# Altium project 2016ship.PrjPcb
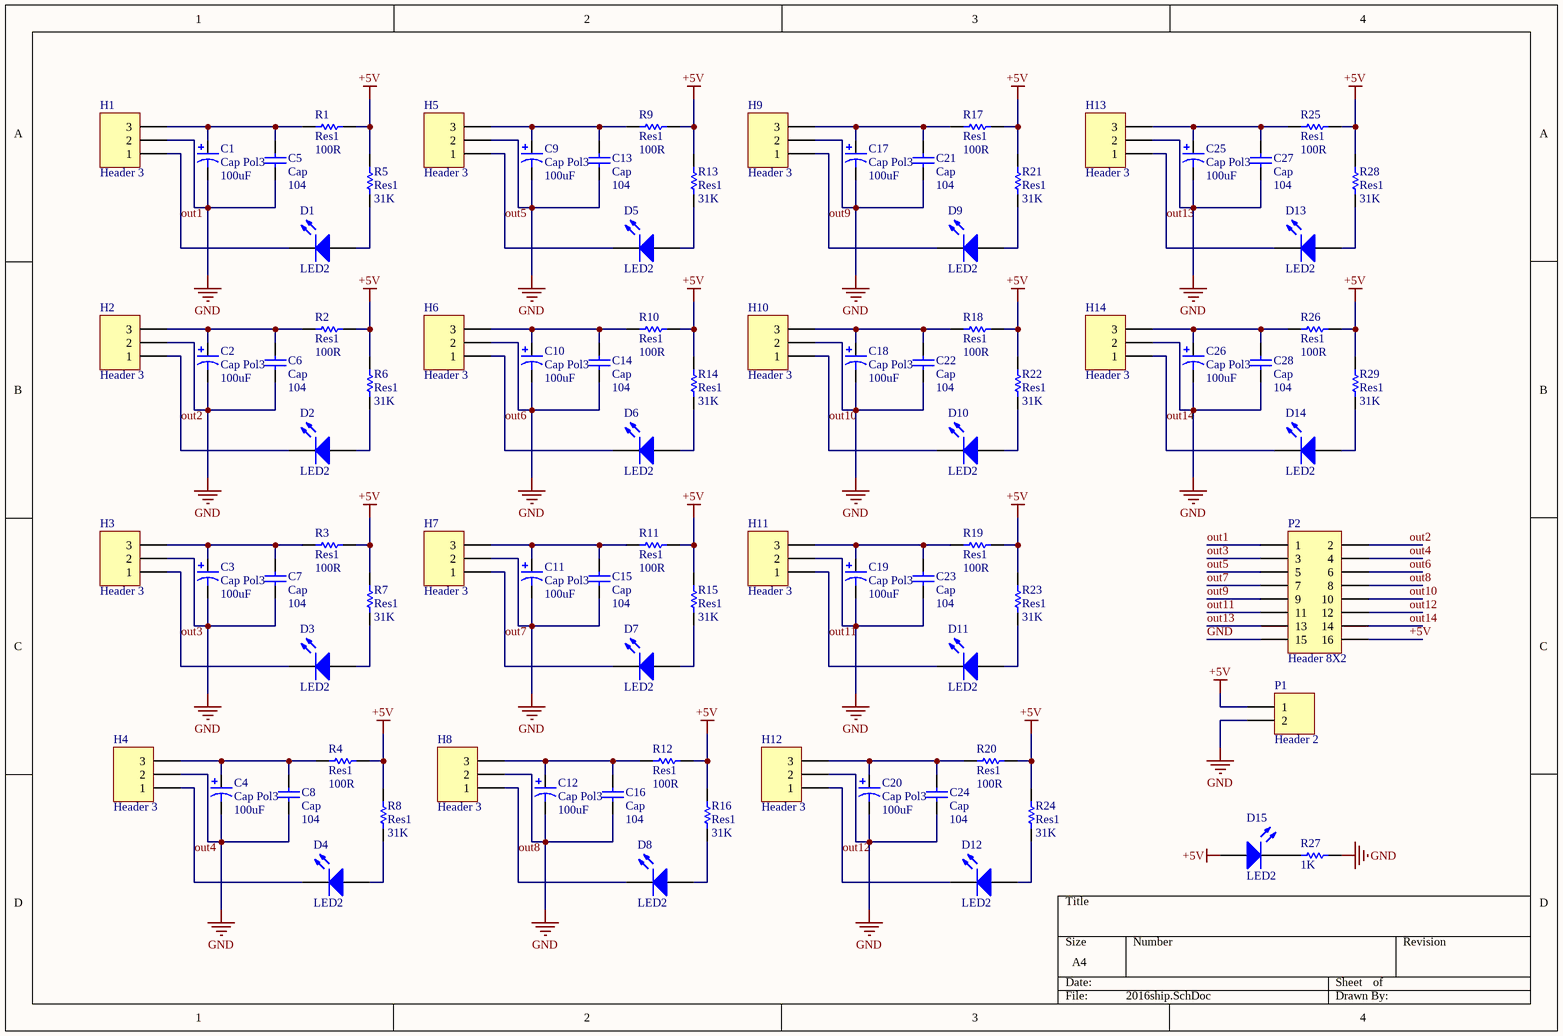
[diagram p0: 2016ship.SchDoc]
1 sheet, 88 parts. Net scope: global (net labels, ports and power ports of the same name join across sheets).
Board file: 2016ship.PcbDoc

## Sheet 2016ship.SchDoc
size A4

### Parts
C1  Cap Pol3  value 100uF  [7343]
C2  Cap Pol3  value 100uF  [7343]
C3  Cap Pol3  value 100uF  [7343]
C4  Cap Pol3  value 100uF  [7343]
C5  Cap  value 104  [0805C]
C6  Cap  value 104  [0805C]
C7  Cap  value 104  [0805C]
C8  Cap  value 104  [0805C]
C9  Cap Pol3  value 100uF  [7343]
C10  Cap Pol3  value 100uF  [7343]
C11  Cap Pol3  value 100uF  [7343]
C12  Cap Pol3  value 100uF  [7343]
C13  Cap  value 104  [0805C]
C14  Cap  value 104  [0805c]
C15  Cap  value 104  [0805C]
C16  Cap  value 104  [0805C]
C17  Cap Pol3  value 100uF  [7343]
C18  Cap Pol3  value 100uF  [7343]
C19  Cap Pol3  value 100uF  [7343]
C20  Cap Pol3  value 100uF  [7343]
C21  Cap  value 104  [0805C]
C22  Cap  value 104  [0805C]
C23  Cap  value 104  [0805C]
C24  Cap  value 104  [0805C]
C25  Cap Pol3  value 100uF  [7343]
C26  Cap Pol3  value 100uF  [7343]
C27  Cap  value 104  [0805C]
C28  Cap  value 104  [0805C]
D1  LED2  [LED-0805]
D2  LED2  [LED-0805]
D3  LED2  [LED-0805]
D4  LED2  [LED-0805]
D5  LED2  [LED-0805]
D6  LED2  [LED-0805]
D7  LED2  [LED-0805]
D8  LED2  [LED-0805]
D9  LED2  [LED-0805]
D10  LED2  [LED-0805]
D11  LED2  [LED-0805]
D12  LED2  [LED-0805]
D13  LED2  [LED-0805]
D14  LED2  [LED-0805]
D15  LED2  [LED-0805]
H1  Header 3  [HDR1X3]
H2  Header 3  [HDR1X3]
H3  Header 3  [HDR1X3]
H4  Header 3  [HDR1X3]
H5  Header 3  [HDR1X3]
H6  Header 3  [HDR1X3]
H7  Header 3  [HDR1X3]
H8  Header 3  [HDR1X3]
H9  Header 3  [HDR1X3]
H10  Header 3  [HDR1X3]
H11  Header 3  [HDR1X3]
H12  Header 3  [HDR1X3]
H13  Header 3  [HDR1X3]
H14  Header 3  [HDR1X3]
P1  Header 2  [HDR1X2]
P2  Header 8X2  [HDR2X8]
R1  Res1  value 100R  [0805R]
R2  Res1  value 100R  [0805R]
R3  Res1  value 100R  [0805R]
R4  Res1  value 100R  [0805R]
R5  Res1  value 31K  [0805R]
R6  Res1  value 31K  [0805R]
R7  Res1  value 31K  [0805R]
R8  Res1  value 31K  [0805R]
R9  Res1  value 100R  [0805R]
R10  Res1  value 100R  [0805R]
R11  Res1  value 100R  [0805R]
R12  Res1  value 100R  [0805R]
R13  Res1  value 31K  [0805R]
R14  Res1  value 31K  [0805R]
R15  Res1  value 31K  [0805R]
R16  Res1  value 31K  [0805R]
R17  Res1  value 100R  [0805R]
R18  Res1  value 100R  [0805R]
R19  Res1  value 100R  [0805R]
R20  Res1  value 100R  [0805R]
R21  Res1  value 31K  [0805R]
R22  Res1  value 31K  [0805R]
R23  Res1  value 31K  [0805R]
R24  Res1  value 31K  [0805R]
R25  Res1  value 100R  [0805R]
R26  Res1  value 100R  [0805R]
R27  value 1K  [0805R]  (hidden comment: Res1)
R28  Res1  value 31K  [0805R]
R29  Res1  value 31K  [0805R]

### Nets
+5V: D15.1(A) P1.1 P2.16 R1.2 R2.2 R3.2 R4.2 R5.2 R6.2 R7.2 R8.2 R9.2 R10.2 R11.2 R12.2 R13.2 R14.2 R15.2 R16.2 R17.2 R18.2 R19.2 R20.2 R21.2 R22.2 R23.2 R24.2 R25.2 R26.2 R28.2 R29.2
GND: C1.2 C2.2 C3.2 C4.2 C5.1 C6.1 C7.1 C8.1 C9.2 C10.2 C11.2 C12.2 C13.1 C14.1 C15.1 C16.1 C17.2 C18.2 C19.2 C20.2 C21.1 C22.1 C23.1 C24.1 C25.2 C26.2 C27.1 C28.1 H1.2 H2.2 H3.2 H4.2 H5.2 H6.2 H7.2 H8.2 H9.2 H10.2 H11.2 H12.2 H13.2 H14.2 P1.2 P2.15 R27.1
out1: D1.2(K) H1.1 P2.1
out2: D2.2(K) H2.1 P2.2
out3: D3.2(K) H3.1 P2.3
out4: D4.2(K) H4.1 P2.4
out5: D5.2(K) H5.1 P2.5
out6: D6.2(K) H6.1 P2.6
out7: D7.2(K) H7.1 P2.7
out8: D8.2(K) H8.1 P2.8
out9: D9.2(K) H9.1 P2.9
out10: D10.2(K) H10.1 P2.10
out11: D11.2(K) H11.1 P2.11
out12: D12.2(K) H12.1 P2.12
out13: D13.2(K) H13.1 P2.13
out14: D14.2(K) H14.1 P2.14
NetC1_1: C1.1 C5.2 H1.3 R1.1
NetC2_1: C2.1 C6.2 H2.3 R2.1
NetC3_1: C3.1 C7.2 H3.3 R3.1
NetC4_1: C4.1 C8.2 H4.3 R4.1
NetC9_1: C9.1 C13.2 H5.3 R9.1
NetC10_1: C10.1 C14.2 H6.3 R10.1
NetC11_1: C11.1 C15.2 H7.3 R11.1
NetC12_1: C12.1 C16.2 H8.3 R12.1
NetC17_1: C17.1 C21.2 H9.3 R17.1
NetC18_1: C18.1 C22.2 H10.3 R18.1
NetC19_1: C19.1 C23.2 H11.3 R19.1
NetC20_1: C20.1 C24.2 H12.3 R20.1
NetC25_1: C25.1 C27.2 H13.3 R25.1
NetC26_1: C26.1 C28.2 H14.3 R26.1
NetD1_1: D1.1(A) R5.1
NetD2_1: D2.1(A) R6.1
NetD3_1: D3.1(A) R7.1
NetD4_1: D4.1(A) R8.1
NetD5_1: D5.1(A) R13.1
NetD6_1: D6.1(A) R14.1
NetD7_1: D7.1(A) R15.1
NetD8_1: D8.1(A) R16.1
NetD9_1: D9.1(A) R21.1
NetD10_1: D10.1(A) R22.1
NetD11_1: D11.1(A) R23.1
NetD12_1: D12.1(A) R24.1
NetD13_1: D13.1(A) R28.1
NetD14_1: D14.1(A) R29.1
NetD15_2: D15.2(K) R27.2

### Library data of the parts
C1-C4 C9-C12 C17-C20 C25 C26 = Cap Pol3: Polarized Capacitor (Surface Mount); Published: 8-Jun-2000; LatestRevisionDate: 29-May-2009; LatestRevisionNote: IPC-7351 Footprint Added.; PackageReference: C0805; Publisher: Altium Limited; PackageDescription: Chip Capacitor
C5-C8 C13-C16 C21-C24 C27 C28 = Cap: Capacitor; Published: 8-Jun-2000; LatestRevisionDate: 17-Jul-2002; LatestRevisionNote: Re-released for DXP Platform.; PackageReference: RAD-0.3; Publisher: Altium Limited; PackageDescription: Radial Cap, Thru-Hole; 2 Leads; 0.3 in Pin Spacing
D1-D15 = LED2: Typical RED, GREEN, YELLOW, AMBER GaAs LED; Published: 8-Jun-2000; LatestRevisionDate: 17-Jul-2002; LatestRevisionNote: Re-released for DXP Platform.; PackageVersion: Feb-2002; PackageReference: 3.2X1.6X1.1; Publisher: Altium Limited; PackageDescription: SM LED; 2 Flat Leads
H1-H14 = Header 3: Header, 3-Pin; LatestRevisionDate: 17-Jul-2002; LatestRevisionNote: Re-released for DXP Platform.; Publisher: Altium Limited
P1 = Header 2: Header, 2-Pin; LatestRevisionDate: 17-Jul-2002; LatestRevisionNote: Re-released for DXP Platform.; Publisher: Altium Limited
P2 = Header 8X2: Header, 8-Pin, Dual row; LatestRevisionDate: 17-Jul-2002; LatestRevisionNote: Re-released for DXP Platform.; Publisher: Altium Limited
R1-R29 = Res1: Resistor; Published: 8-Jun-2000; LatestRevisionDate: 17-Jul-2002; LatestRevisionNote: Re-released for DXP Platform.; PackageReference: AXIAL-0.3; Publisher: Altium Limited; PackageDescription: Axial Device, Thru-Hole; 2 Leads; 0.3 in Pin Spacing